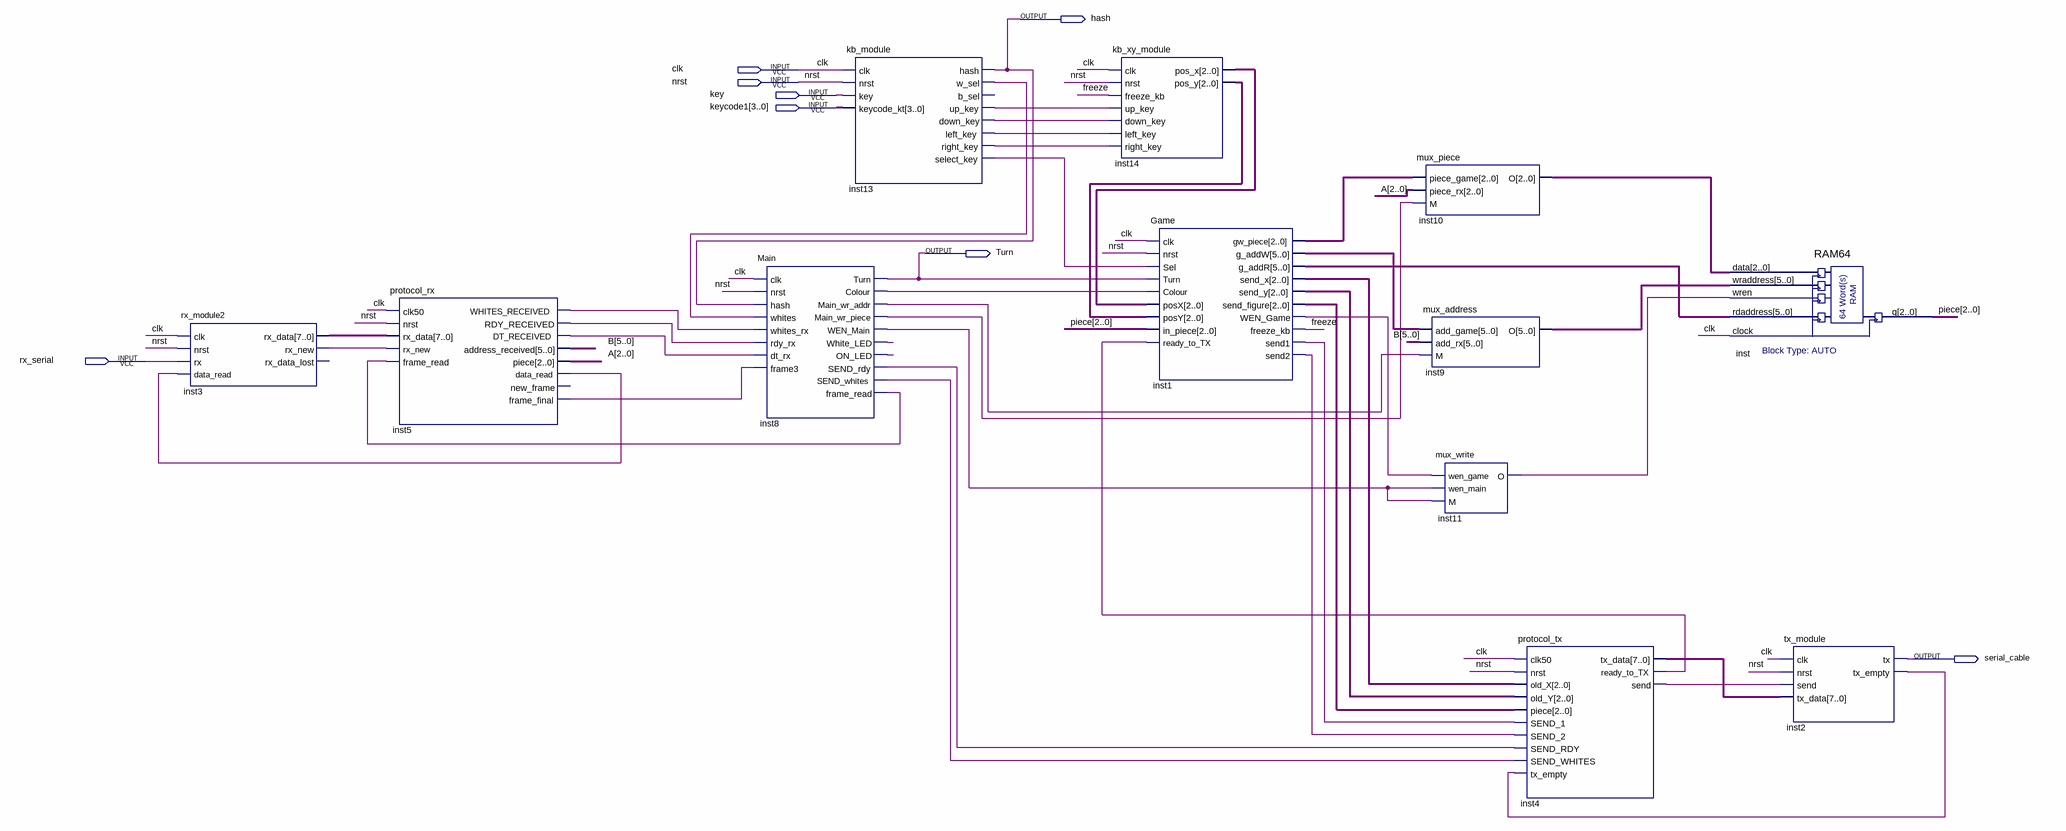
[diagram p0: schematic sheet]
// Quartus schematic sender_ram.bdf as structural Verilog: 12 symbols, 8 pins
module sender_ram (
  input  clk,
  input  nrst,
  input  key,
  input  [3:0] keycode1,
  input  rx_serial,
  output hash,
  output Turn,
  output serial_cable
);

  wire freeze, inst1_send1, inst1_send2, inst1_wen_game, inst2_tx_empty, inst3_rx_new, inst4_ready_to_tx,
       inst4_send, inst5_data_read, inst5_dt_received, inst5_frame_final, inst5_rdy_received,
       inst5_whites_received, inst8_colour, inst8_frame_read, inst8_main_wr_addr, inst8_main_wr_piece,
       inst8_on_led, inst8_send_rdy, inst8_send_whites, inst8_wen_main, inst8_white_led, inst11_o,
       inst13_down_key, inst13_left_key, inst13_right_key, inst13_select_key, inst13_up_key, inst13_w_sel;
  wire [2:0] A, inst1_gw_piece, inst1_send_figure, inst1_send_x, inst1_send_y, inst10_o, inst14_pos_x,
       inst14_pos_y, piece;
  wire [5:0] B, inst1_g_addr, inst1_g_addw, inst9_o;
  wire [7:0] inst3_rx_data, inst4_tx_data;

  rx_module2 inst3 (
    .clk(clk), .nrst(nrst), .rx(rx_serial), .data_read(inst5_data_read), .rx_data(inst3_rx_data),
    .rx_new(inst3_rx_new));  // open: rx_data_lost
  protocol_rx inst5 (
    .clk50(clk), .nrst(nrst), .rx_data(inst3_rx_data), .rx_new(inst3_rx_new), .frame_read(inst8_frame_read),
    .WHITES_RECEIVED(inst5_whites_received), .RDY_RECEIVED(inst5_rdy_received),
    .DT_RECEIVED(inst5_dt_received), .address_received(B), .piece(A), .data_read(inst5_data_read),
    .frame_final(inst5_frame_final));  // open: new_frame
  Main inst8 (
    .clk(clk), .nrst(nrst), .hash(hash), .whites(inst13_w_sel), .whites_rx(inst5_whites_received),
    .rdy_rx(inst5_rdy_received), .dt_rx(inst5_dt_received), .frame3(inst5_frame_final), .Turn(Turn),
    .Colour(inst8_colour), .Main_wr_addr(inst8_main_wr_addr), .Main_wr_piece(inst8_main_wr_piece),
    .WEN_Main(inst8_wen_main), .White_LED(inst8_white_led), .ON_LED(inst8_on_led), .SEND_rdy(inst8_send_rdy),
    .SEND_whites(inst8_send_whites), .frame_read(inst8_frame_read));
  kb_module inst13 (
    .clk(clk), .nrst(nrst), .key(key), .keycode_kt(keycode1), .hash(hash), .w_sel(inst13_w_sel),
    .up_key(inst13_up_key), .down_key(inst13_down_key), .left_key(inst13_left_key),
    .right_key(inst13_right_key), .select_key(inst13_select_key));  // open: b_sel
  kb_xy_module inst14 (
    .clk(clk), .nrst(nrst), .freeze_kb(freeze), .up_key(inst13_up_key), .down_key(inst13_down_key),
    .left_key(inst13_left_key), .right_key(inst13_right_key), .pos_x(inst14_pos_x), .pos_y(inst14_pos_y));
  Game inst1 (
    .clk(clk), .nrst(nrst), .Sel(inst13_select_key), .Turn(Turn), .Colour(inst8_colour), .posX(inst14_pos_x),
    .posY(inst14_pos_y), .in_piece(piece), .ready_to_TX(inst4_ready_to_tx), .gw_piece(inst1_gw_piece),
    .g_addW(inst1_g_addw), .g_addR(inst1_g_addr), .send_x(inst1_send_x), .send_y(inst1_send_y),
    .send_figure(inst1_send_figure), .WEN_Game(inst1_wen_game), .freeze_kb(freeze), .send1(inst1_send1),
    .send2(inst1_send2));
  mux_piece inst10 (.piece_game(inst1_gw_piece), .piece_rx(A), .M(inst8_main_wr_piece), .O(inst10_o));
  mux_address inst9 (.add_game(inst1_g_addw), .add_rx(B), .M(inst8_main_wr_addr), .O(inst9_o));
  mux_write inst11 (.wen_game(inst1_wen_game), .wen_main(inst8_wen_main), .M(inst8_wen_main), .O(inst11_o));
  protocol_tx inst4 (
    .clk50(clk), .nrst(nrst), .old_X(inst1_send_x), .old_Y(inst1_send_y), .piece(inst1_send_figure),
    .SEND_1(inst1_send1), .SEND_2(inst1_send2), .SEND_RDY(inst8_send_rdy), .SEND_WHITES(inst8_send_whites),
    .tx_empty(inst2_tx_empty), .tx_data(inst4_tx_data), .ready_to_TX(inst4_ready_to_tx), .send(inst4_send));
  RAM64 inst (.data(inst10_o), .wraddress(inst9_o), .wren(inst11_o), .rdaddress(inst1_g_addr), .clock(clk), .q(piece));
  tx_module inst2 (
    .clk(clk), .nrst(nrst), .send(inst4_send), .tx_data(inst4_tx_data), .tx(serial_cable),
    .tx_empty(inst2_tx_empty));
endmodule
